# Altium schematic sheet [7]-GSM_MODEM_MAIN.SchDoc
size A4
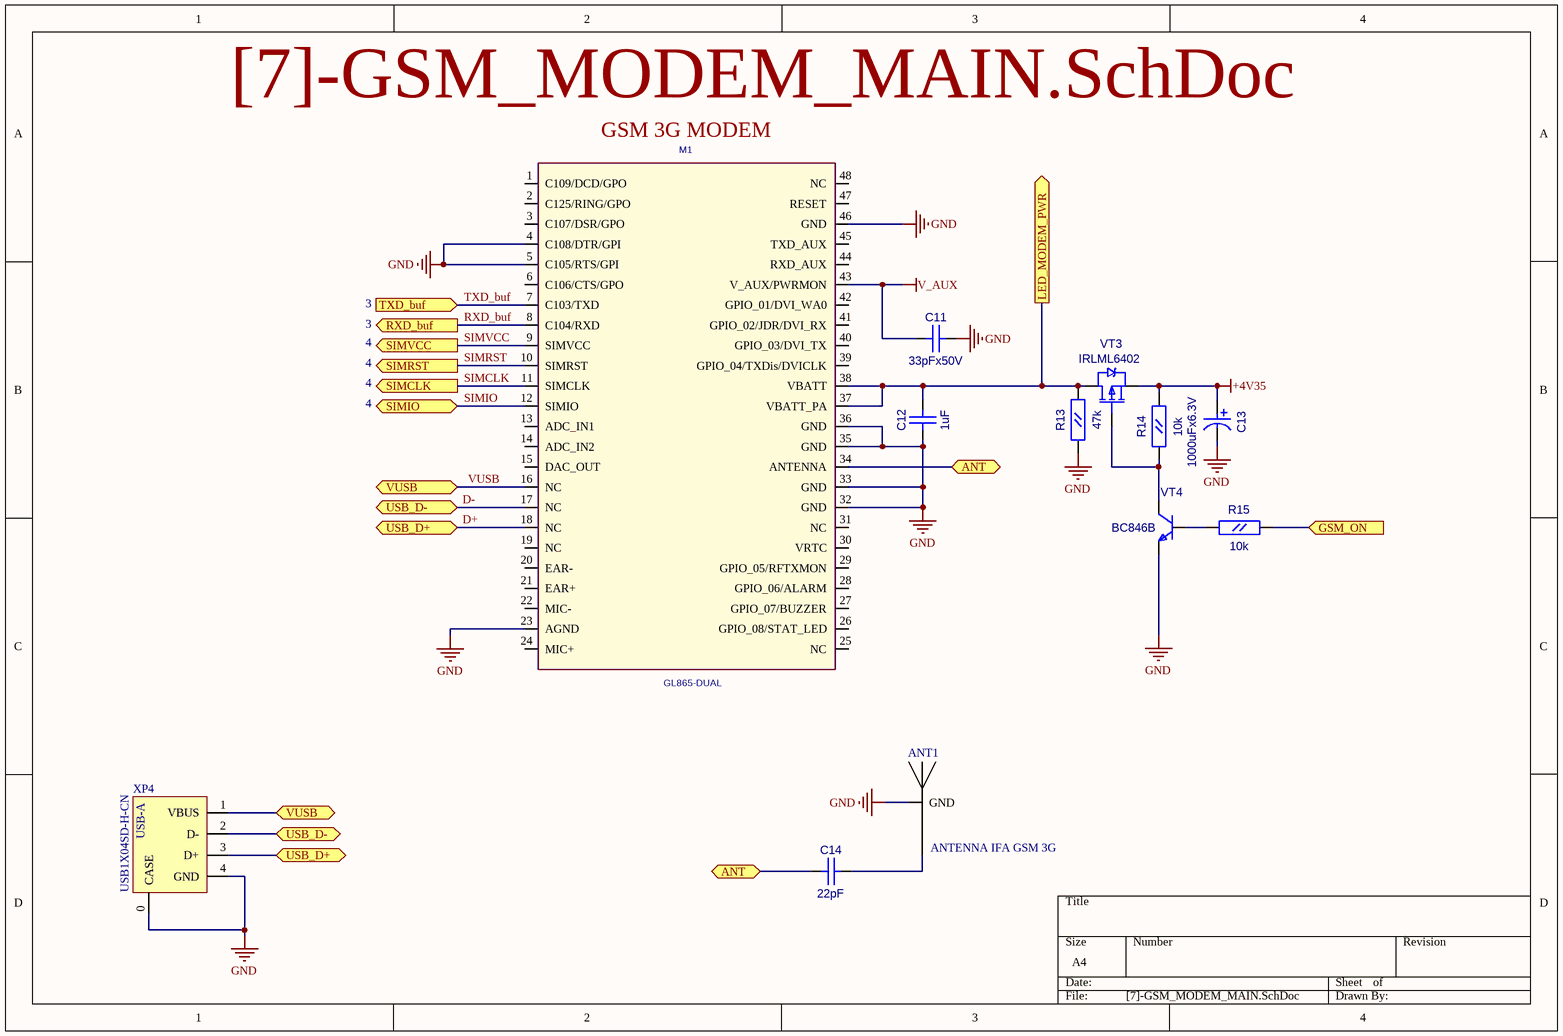
[diagram p0: [7]-GSM_MODEM_MAIN.SchDoc]

## Parts
ANT1  ANTENNA IFA GSM 3G  [IFA_GSM_3G]
C11  33pFx50V  [CC0603]
C12  1uF  [CC0603]
C13  value 1000uFx6.3V  [CC8X3.5]  (hidden comment: CAP0.35)
C14  22pF  [CC0603]
M1  GL865-DUAL  [GL868-DUAL]
R13  47k  [RC0603]
R14  10k  [RC0603]
R15  10k  [RC0603]
VT3  IRLML6402  [SOT-23(123)]
VT4  BC846B  [SOT-23(123)]
XP4  USB1X04SD-H-CN  [USB_A_FRONT]

## Ports
ANT (bidir), GSM_ON (in), LED_MODEM_PWR (out), RXD_buf (out), SIMCLK (out), SIMIO (bidir), SIMRST (out), SIMVCC (out), TXD_buf (in), USB_D+ (bidir), USB_D- (bidir), VUSB (bidir)

## Nets
+4V35: C13.1 R14.2(B) VT3.2(S)
GND: ANT1.2(GND) C11.2(B) C12.1(A) C13.2 M1.4(C108/DTR/GPI) M1.5(C105/RTS/GPI) M1.23(AGND) M1.32(GND) M1.33(GND) M1.35(GND) M1.36(GND) M1.46(GND) R13.1(A) VT4.2(E) XP4.0(CASE) XP4.4(GND)
V_AUX: C11.1(A) M1.43(V_AUX/PWRMON)
ANT: C14.1(A) M1.34(ANTENNA) ; port ANT
D+: M1.18(NC) XP4.3(D+) ; port USB_D+
D-: M1.17(NC) XP4.2(D-) ; port USB_D-
GSM_ON: R15.2(B) ; port GSM_ON
LED_MODEM_PWR: C12.2(B) M1.37(VBATT_PA) M1.38(VBATT) R13.2(B) VT3.3(D) ; port LED_MODEM_PWR
RXD_buf: M1.8(C104/RXD) ; port RXD_buf
SIMCLK: M1.11(SIMCLK) ; port SIMCLK
SIMIO: M1.12(SIMIO) ; port SIMIO
SIMRST: M1.10(SIMRST) ; port SIMRST
SIMVCC: M1.9(SIMVCC) ; port SIMVCC
TXD_buf: M1.7(C103/TXD) ; port TXD_buf
VUSB: M1.16(NC) XP4.1(VBUS) ; port VUSB
NetANT1_1: ANT1.1(RF_IN) C14.2(B)
NetR14_1: R14.1(A) VT3.1(G) VT4.3(C)
NetR15_1: R15.1(A) VT4.1(B)

Not connected (* = marked no-connect by the designer): M1 1(C109/DCD/GPO) 2(C125/RING/GPO) 3(C107/DSR/GPO) 6(C106/CTS/GPO) 13(ADC_IN1) 14(ADC_IN2) 15(DAC_OUT) 19(NC) 20(EAR-) 21(EAR+) 22(MIC-) 24(MIC+) 25(NC) 26(GPIO_08/STAT_LED) 27(GPIO_07/BUZZER) 28(GPIO_06/ALARM) 29(GPIO_05/RFTXMON) 30(VRTC) 31(NC) 39(GPIO_04/TXDis/DVICLK) 40(GPIO_03/DVI_TX) 41(GPIO_02/JDR/DVI_RX) 42(GPIO_01/DVI_WA0) 44(RXD_AUX) 45(TXD_AUX) 47(RESET) 48(NC)

## Notes on the sheet
- (near M1) GSM 3G MODEM
- 3
- 4
- (in symbol USB_A_VERTICAL) USB-A

## Library data of the parts
ANT1 = ANTENNA_IFA_GSM_3G: 1.6mm Er=4.4
C11 C12 C14 = CC0603
  C11: Value: 33pFx50V
  C12: Value: 1uF
  C14: Value: 22pF
M1 = GL868-DUAL: Value: *
R13-R15 = RC0603
  R13: Value: 47k
  R14 R15: Value: 10k
VT3 = IRLML6402: HEXFET Power MOSFET; OriginalName: IRLML5103; ComponentField7: Published 8-Jun-2000; Value: IRLML6402
VT4 = BC846BLT1: ComponentField7: Published 29-Sep-2000; OriginalName: BC846BLT1; Value: BC846B
XP4 = USB_A_VERTICAL: Vertical USB connetctor,type A.THR; Value: USB1X04SD-H-CN